# Altium schematic sheet 通讯部分.SchDoc
size A4; DocumentNumber: 2; SheetNumber: 2; SheetTotal: 2
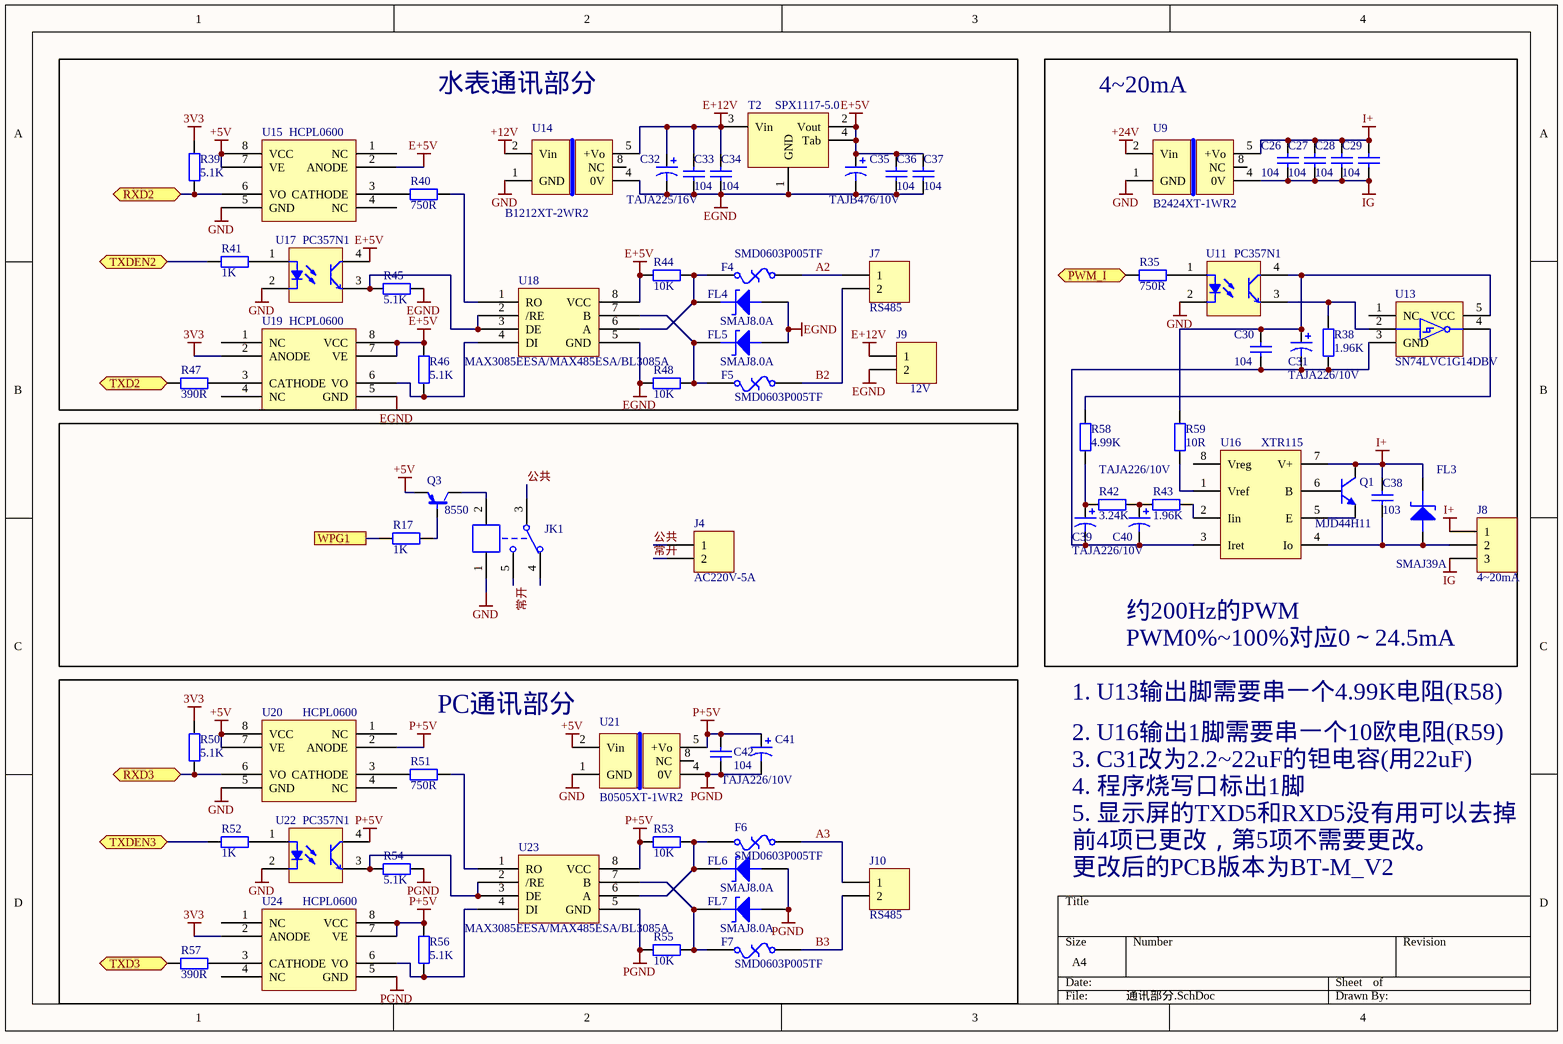
[diagram p0: 通讯部分.SchDoc]

## Parts
C26  104  [C 0603_M]
C27  104  [C 0603_M]
C28  104  [C 0603_M]
C29  104  [C 0603_M]
C30  104  [C 0603_M]
C31  TAJA226/10V  [3216]
C32  TAJA225/16V  [3216]
C33  104  [C 0603_M]
C34  104  [C 0603_M]
C35  TAJB476/10V  [3528]
C36  104  [C 0603_M]
C37  104  [C 0603_M]
C38  103  [C 0603_M]
C39  TAJA226/10V  [3216]
C40  TAJA226/10V  [3216]
C41  TAJA226/10V  [3216]
C42  104  [C 0603_M]
F4  SMD0603P005TF  [R 0603_M]
F5  SMD0603P005TF  [R 0603_M]
F6  SMD0603P005TF  [R 0603_M]
F7  SMD0603P005TF  [R 0603_M]
FL3  SMAJ39A  [SMA]
FL4  SMAJ8.0A  [SMA]
FL5  SMAJ8.0A  [SMA]
FL6  SMAJ8.0A  [SMA]
FL7  SMAJ8.0A  [SMA]
J4  AC220V-5A  [KF128-5.08-2P]
J7  RS485  [KF128-5.08-2P]
J8  4~20mA  [KF128-5.08-3P]
J9  12V  [KF128-5.08-2P]
J10  RS485  [KF128-5.08-2P]
JK1  (no value)  [SRD-C_B]
Q1  MJD44H11  [DPAK]
Q3  8550  [SOT-23]
R17  1K  [R 0603_M]
R35  750R  [R 0603_M]
R38  1.96K  [R 0603_M]
R39  5.1K  [R 0603_M]
R40  750R  [R 0603_M]
R41  1K  [R 0603_M]
R42  3.24K  [R 0603_M]
R43  1.96K  [R 0603_M]
R44  10K  [R 0603_M]
R45  5.1K  [R 0603_M]
R46  5.1K  [R 0603_M]
R47  390R  [R 0603_M]
R48  10K  [R 0603_M]
R50  5.1K  [R 0603_M]
R51  750R  [R 0603_M]
R52  1K  [R 0603_M]
R53  10K  [R 0603_M]
R54  5.1K  [R 0603_M]
R55  10K  [R 0603_M]
R56  5.1K  [R 0603_M]
R57  390R  [R 0603_M]
R58  4.99K  [R 0603_M]
R59  10R  [R 0603_M]
T2  SPX1117-5.0  [SOT-223]
U9  B2424XT-1WR2  [B_XT-1W]
U11  PC357N1  [PC357]
U13  SN74LVC1G14DBV  [SOT-23-5]
U14  B1212XT-2WR2  [B_XT-1W]
U15  HCPL0600  [SO-8]
U16  XTR115  [SO-8]
U17  PC357N1  [PC357]
U18  MAX3085EESA/MAX485ESA/BL3085A  [SO-8]
U19  HCPL0600  [SO-8]
U20  HCPL0600  [SO-8]
U21  B0505XT-1WR2  [B_XT-1W]
U22  PC357N1  [PC357]
U23  MAX3085EESA/MAX485ESA/BL3085A  [SO-8]
U24  HCPL0600  [SO-8]

## Blocks framed on the sheet
水表通讯部分: C32-C37 F4 F5 FL4 FL5 J7 J9 R39-R41 R44-R48 T2 U14 U15 U17-U19
PC通讯部分: C41 C42 F6 F7 FL6 FL7 J10 R50-R57 U20-U24

## Ports
PWM_I (bidir), RXD2 (bidir), RXD3 (bidir), TXD2 (bidir), TXD3 (bidir), TXDEN2 (bidir), TXDEN3 (bidir), WPG1

## Nets
3V3: R39.2 R50.2 U19.2(ANODE) U24.2(ANODE)
+5V: Q3.2(e) U15.7(VE) U15.8(VCC) U20.7(VE) U20.8(VCC) U21.2(Vin)
+12V: U14.2(Vin)
+24V: U9.2(Vin)
E+5V: C35.1 C36.2 C37.2 R44.2 R46.2 T2.2(Vout) T2.4(Tab) U15.2(ANODE) U17.4 U18.8(VCC) U19.7(VE) U19.8(VCC)
E+12V: C32.1 C33.2 C34.2 J9.1 T2.3(Vin) U14.5(+Vo)
EGND: C32.2 C33.1 C34.1 C35.2 C36.1 C37.1 FL4.1(A) FL5.1(A) J9.2 R45.2 R48.2 T2.1(GND) U14.4(0V) U18.5(GND) U19.5(GND)
GND: JK1.1 U9.1(GND) U11.2 U14.1(GND) U15.5(GND) U17.2 U20.5(GND) U21.1(GND) U22.2
I+: C26.2 C27.2 C28.2 C29.2 C38.2 FL3.2(K) J8.1 Q1.2(C) U9.5(+Vo) U16.7(V+)
IG: C26.1 C27.1 C28.1 C29.1 J8.3 U9.4(0V)
P+5V: C41.1 C42.2 R53.2 R56.2 U20.2(ANODE) U21.5(+Vo) U22.4 U23.8(VCC) U24.7(VE) U24.8(VCC)
PGND: C41.2 C42.1 FL6.1(A) FL7.1(A) R54.2 R55.2 U21.4(0V) U23.5(GND) U24.5(GND)
A2: F4.1 J7.1
A3: F6.1 J10.1
B2: F5.1 J7.2
B3: F7.1 J10.2
PWM_I: R35.1 ; port PWM_I
RXD2: R39.1 U15.6(VO) ; port RXD2
RXD3: R50.1 U20.6(VO) ; port RXD3
TXD2: R47.1 ; port TXD2
TXD3: R57.1 ; port TXD3
TXDEN2: R41.1 ; port TXDEN2
TXDEN3: R52.1 ; port TXDEN3
WPG1: R17.1 ; port WPG1
公共: J4.1 JK1.3
常开: J4.2 JK1.5
NetC30_1: C30.1 C31.2 C39.2 C40.2 R38.1 U13.3(GND) U16.3(Iret)
NetC30_2: C30.2 C31.1 R59.2 U11.4 U13.5(VCC)
NetC38_1: C38.1 FL3.1(A) J8.2 U16.4(Io)
NetC39_1: C39.1 R42.1 R58.1
NetC40_1: C40.1 R42.2 R43.1
NetF4_2: F4.2 FL4.2(K) R44.1 U18.6(A)
NetF5_2: F5.2 FL5.2(K) R48.1 U18.7(B)
NetF6_2: F6.2 FL6.2(K) R53.1 U23.6(A)
NetF7_2: F7.2 FL7.2(K) R55.1 U23.7(B)
NetJK1_2: JK1.2 Q3.3(c)
NetQ1_1: Q1.1(B) U16.6(B)
NetQ1_3: Q1.3(E) U16.5(E)
NetQ3_1: Q3.1(b) R17.2
NetR35_2: R35.2 U11.1
NetR38_2: R38.2 U11.3 U13.2
NetR40_1: R40.1 U15.3(CATHODE)
NetR40_2: R40.2 U18.1(RO)
NetR41_2: R41.2 U17.1
NetR43_2: R43.2 U16.2(Iin)
NetR45_1: R45.1 U17.3 U18.2(/RE) U18.3(DE)
NetR46_1: R46.1 U18.4(DI) U19.6(VO)
NetR47_2: R47.2 U19.3(CATHODE)
NetR51_1: R51.1 U20.3(CATHODE)
NetR51_2: R51.2 U23.1(RO)
NetR52_2: R52.2 U22.1
NetR54_1: R54.1 U22.3 U23.2(/RE) U23.3(DE)
NetR56_1: R56.1 U23.4(DI) U24.6(VO)
NetR57_2: R57.2 U24.3(CATHODE)
NetR58_2: R58.2 U13.4
NetR59_1: R59.1 U16.1(Vref)

Not connected (* = marked no-connect by the designer): JK1 4; U9 8(NC); U13 1(NC); U14 8(NC); U15 1(NC) 4(NC); U16 8(Vreg); U19 1(NC) 4(NC); U20 1(NC) 4(NC); U21 8(NC); U24 1(NC) 4(NC)

## Notes on the sheet
- 4~20mA
- PWM0%~100%对应0～24.5mA
- 约200Hz的PWM
- 1. U13输出脚需要串一个4.99K电阻(R58)
- 2. U16输出1脚需要串一个10欧电阻(R59)
- 3. C31改为2.2~22uF的钽电容(用22uF)
- 5. 显示屏的TXD5和RXD5没有用可以去掉
- 4. 程序烧写口标出1脚
- 前4项已更改，第5项不需要更改。
- 更改后的PCB版本为BT-M_V2

## Library data of the parts
C26-C30 C33 C34 C36-C38 C42 = Cap Semi: Capacitor (Semiconductor SIM Model); Published: 8-Jun-2000; LatestRevisionDate: 17-Jul-2002; LatestRevisionNote: Re-released for DXP Platform.; PackageReference: C1206; Publisher: Altium Limited
C31 C32 C35 C39-C41 = Cap Pol1: Polarized Capacitor (Radial); Published: 8-Jun-2000; LatestRevisionDate: 17-Jul-2002; LatestRevisionNote: Re-released for DXP Platform.; PackageReference: RB7.6-15; Publisher: Altium Limited
F4-F7 = Fuse Thermal: Thermal Fuse; Published: 24-Mar-1999; LatestRevisionDate: 17-Jul-2002; LatestRevisionNote: Re-released for DXP Platform.; PackageReference: PIN-W2/E2.8; Publisher: 50mA
FL3-FL7 = ZENER2: Zener Diode
J4 J7 J9 J10 = Header 2: Header, 2-Pin; LatestRevisionDate: 17-Jul-2002; LatestRevisionNote: Re-released for DXP Platform.; Publisher: Altium Limited
J8 = Header 3: Header, 3-Pin; LatestRevisionDate: 17-Jul-2002; LatestRevisionNote: Re-released for DXP Platform.; Publisher: Altium Limited
JK1 = SRD-05VDC-SL-C: 5V单路双控继电器; BOM名称: 5V继电器; 版权归属: 源创客; 学习资源: www.ooocke.com
Q1 = MJD44H11: NPN Bipolar Transistor; Published: 8-Jun-2000; LatestRevisionDate: 17-Jul-2002; LatestRevisionNote: Re-released for DXP Platform.; PackageReference: TO-226; Publisher: Altium Limited; Code_JEDEC: TO-226-AA
Q3 = PNP
R17 R35 R38-R48 R50-R59 = Res2: Resistor; Published: 8-Jun-2000; LatestRevisionDate: 17-Jul-2002; LatestRevisionNote: Re-released for DXP Platform.; PackageReference: AXIAL-0.4; Publisher: Altium Limited
T2 = 1117
U9 U14 U21 = B_XT-1W
U11 U17 U22 = TLP521-1
U15 U19 U20 U24 = 6N137
U18 U23 = MAX485